# Altium schematic sheet WiFiNode_Per_R00.SchDoc: Nodo WiFi
size A4; Author: Hernan M. Travado; Revision: 0; SheetNumber: 4; SheetTotal: 5
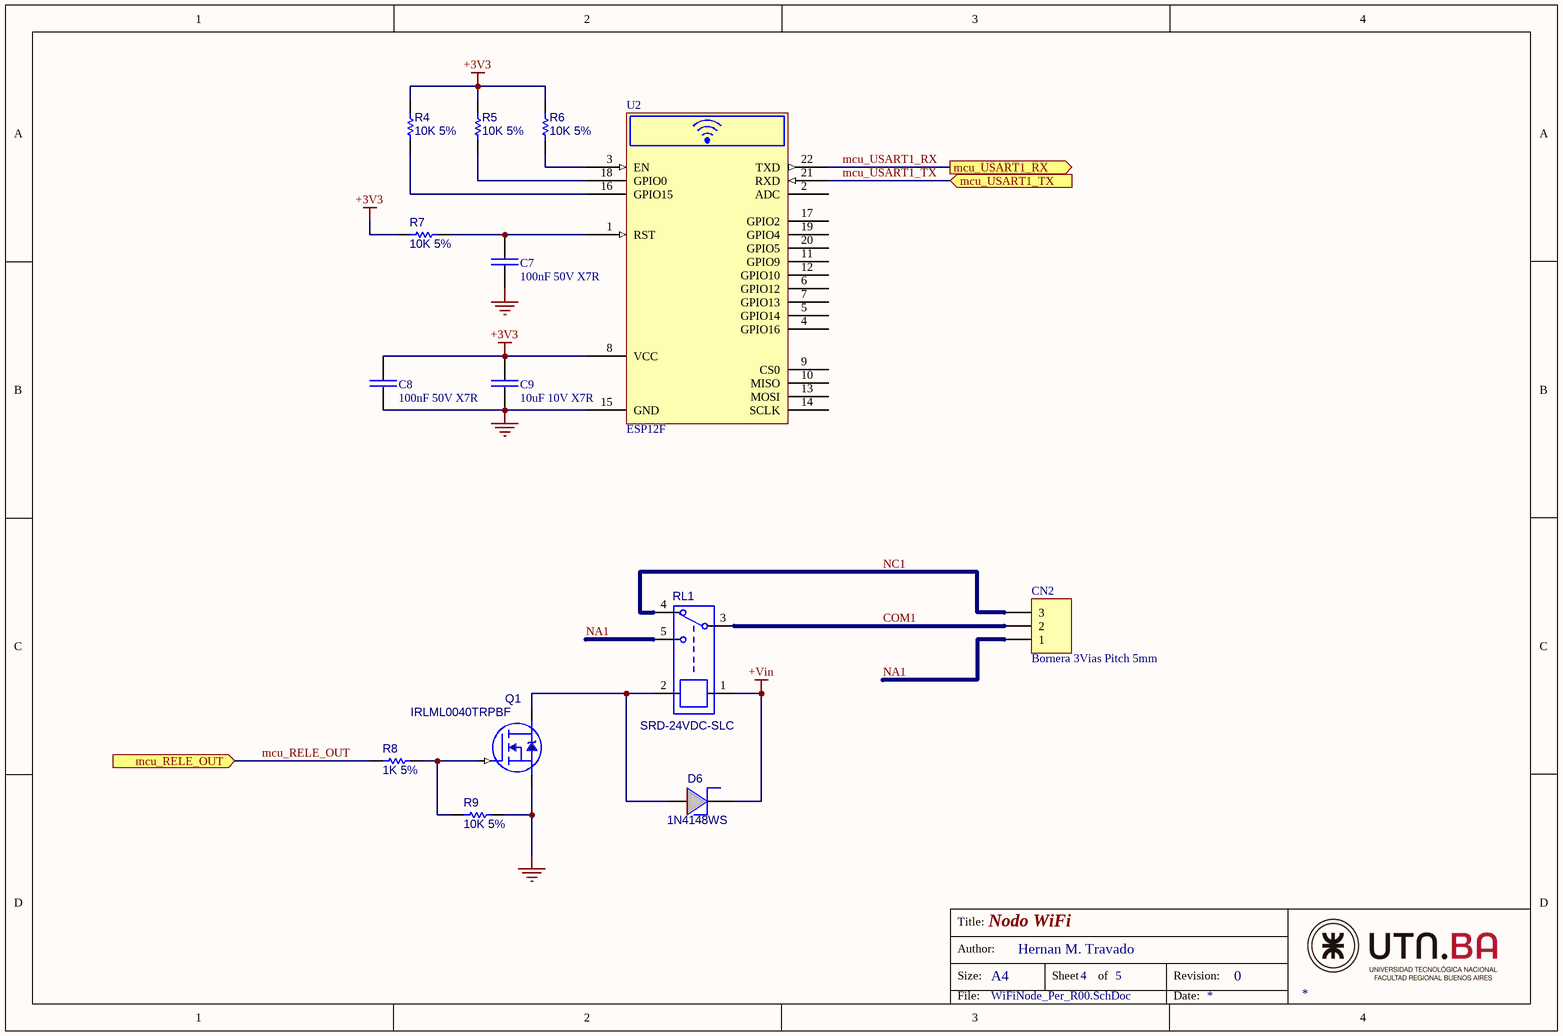
[diagram p0: WiFiNode_Per_R00.SchDoc]

## Parts
C7  100nF 50V X7R  [C_0805]
C8  100nF 50V X7R  [C_0805]
C9  10uF 10V X7R  [C_0805]
CN2  Bornera 3Vias Pitch 5mm  [TerminalBlock_1x3_P5mm]
D6  1N4148WS  [SOD_323]
Q1  IRLML0040TRPBF  [SOT_23]
R4  10K 5%  [R_0805]
R5  10K 5%  [R_0805]
R6  10K 5%  [R_0805]
R7  10K 5%  [R_0805]
R8  1K 5%  [R_0805]
R9  10K 5%  [R_0805]
RL1  SRD-24VDC-SLC  [943-1C]
U2  ESP12F  [ESP12F]

## Ports
mcu_RELE_OUT (in, see WiFiNode_Blk_R00[4C], WiFiNode_CPU1_R00[3B]), mcu_USART1_RX (out, see WiFiNode_Blk_R00[4C], WiFiNode_CPU1_R00[3B]), mcu_USART1_TX (in, see WiFiNode_Blk_R00[4C], WiFiNode_CPU1_R00[3B])

## Nets
+3V3: C8.1 C9.1 R4.2 R5.2 R6.2 R7.2 U2.8(VCC)
+Vin: D6.2(K) RL1.1
GND: C7.2 C8.2 C9.2 Q1.2(SOURCE) R9.1 U2.15(GND)
COM1: CN2.2 RL1.3
mcu_RELE_OUT: R8.2 ; port mcu_RELE_OUT
mcu_USART1_RX: U2.22(TXD) ; port mcu_USART1_RX
mcu_USART1_TX: U2.21(RXD) ; port mcu_USART1_TX
NA1: CN2.1 RL1.5
NC1: CN2.3 RL1.4
NetC7_1: C7.1 R7.1 U2.1(RST)
NetD6_1: D6.1(A) Q1.3(DRAIN) RL1.2
NetQ1_1: Q1.1(GATE) R8.1 R9.2
NetR4_1: R4.1 U2.16(GPIO15)
NetR5_1: R5.1 U2.18(GPIO0)
NetR6_1: R6.1 U2.3(EN)

Not connected (* = marked no-connect by the designer): U2 2(ADC) 4(GPIO16) 5(GPIO14) 6(GPIO12) 7(GPIO13) 9(CS0) 10(MISO) 11(GPIO9) 12(GPIO10) 13(MOSI) 14(SCLK) 17(GPIO2) 19(GPIO4) 20(GPIO5)

## Notes on the sheet
- Title:
- Size:
- Author:
- A4
- Sheet
- of
- Revision:
- File:
- Date:

## Library data of the parts
C7-C9 = Ceramic capacitor
CN2 = CONN_03P: Connector Generic 3 Vias
D6 = DIODO_SH: Diode Shottky
Q1 = N_MOSFET_SOT23: Mosfet N-Ch
R4-R9 = Res1: Resistor
RL1 = RELAY SPDT
U2 = ESP12F Wifi Module: Wifi Module